# EAGLE schematic CFO_nano_protoWithDACandOpAmpMCP4822 (EAGLE 9.2.2)
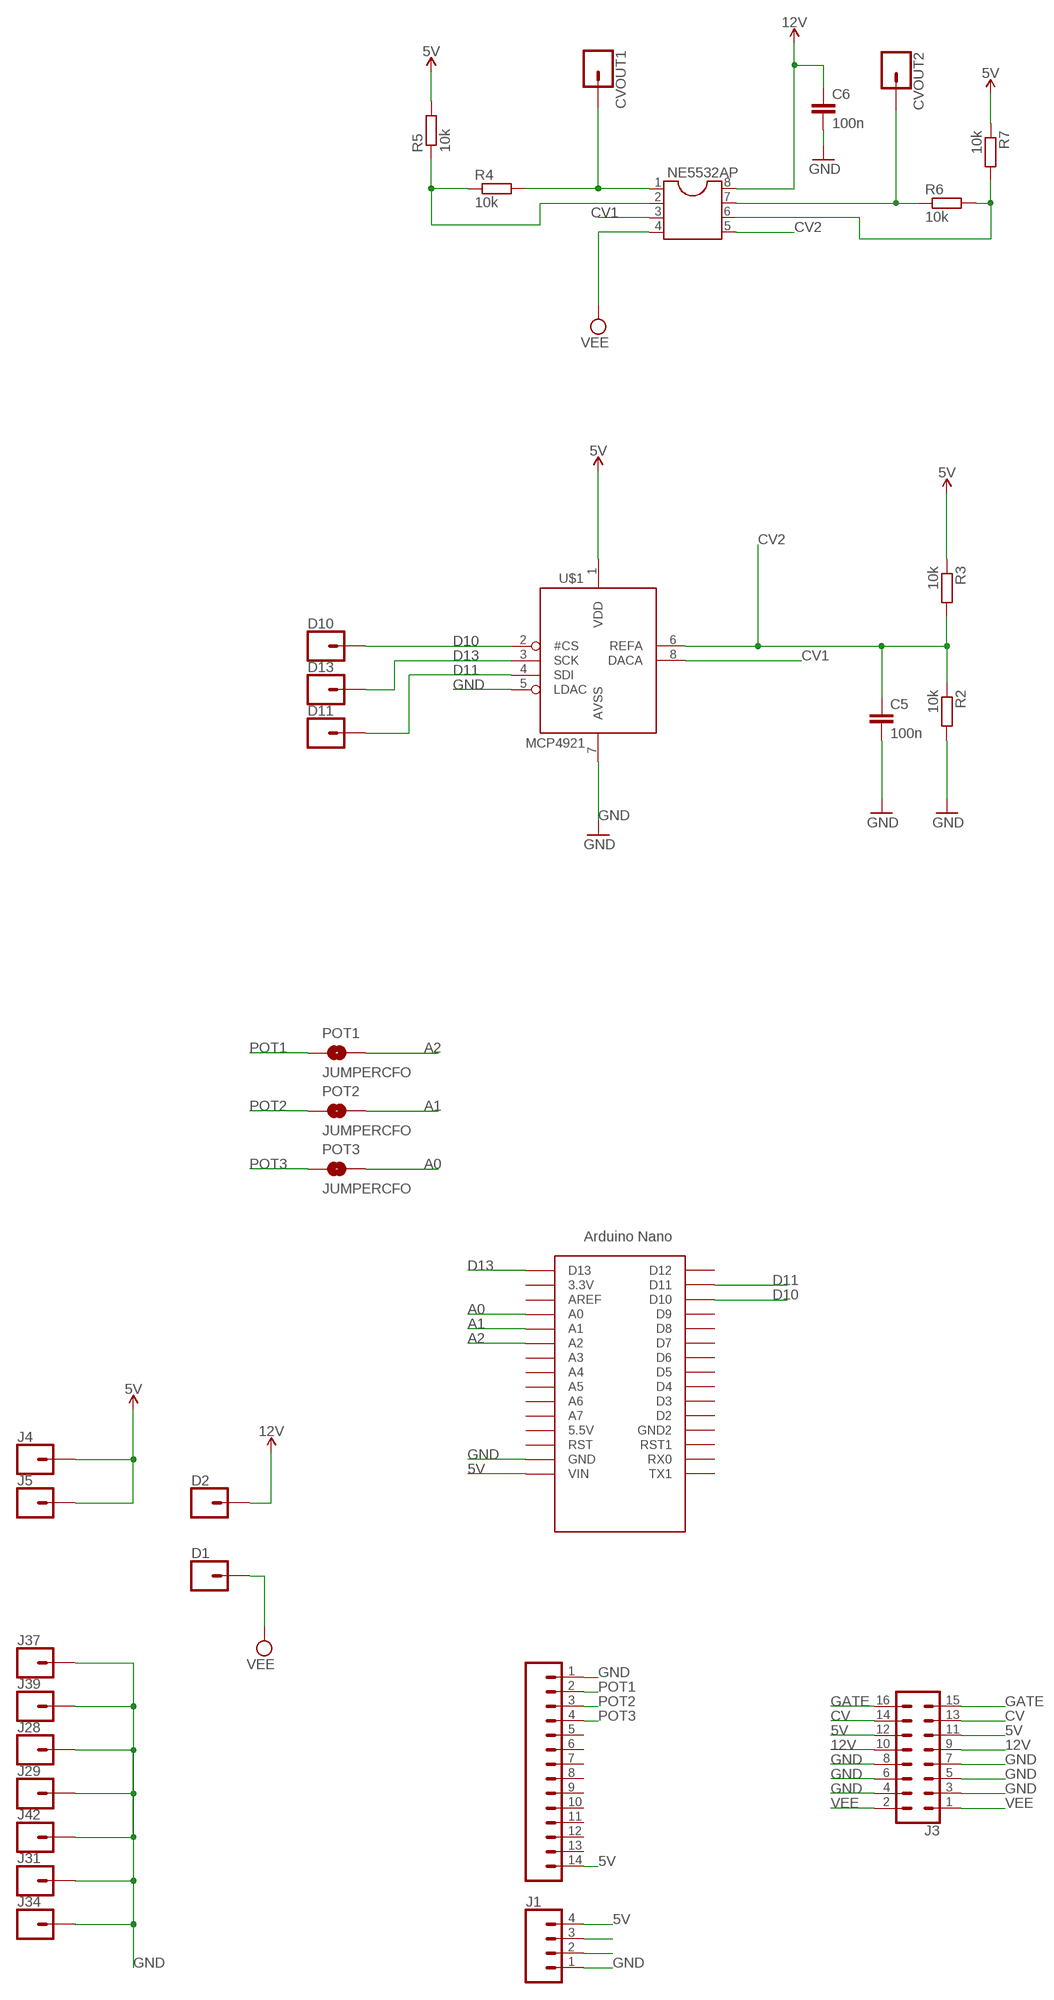
[diagram p0: schematic, sheet 1]

## Parts
C5  100n  C-EU050-025X075  [C050-025X075]
C6  100n  C-EU050-025X075  [C050-025X075]
CVOUT1  CONN_01  [1X01]
CVOUT2  CONN_01  [1X01]
D1  CONN_01  [1X01]
D2  CONN_01  [1X01]
D10  CONN_01  [1X01]
D11  CONN_01  [1X01]
D13  CONN_01  [1X01]
J1  CONN_04  [1X04]
J2  CONN_14SQUARE  [1X14]
J3  CONN_08X2_SHROUD  [2X8-SHROUDED_LOCK]
J4  CONN_01  [1X01]
J5  CONN_01  [1X01]
J28  CONN_01  [1X01]
J29  CONN_01  [1X01]
J31  CONN_01  [1X01]
J34  CONN_01  [1X01]
J37  CONN_01  [1X01]
J39  CONN_01  [1X01]
J42  CONN_01  [1X01]
NE5532AP  DIL8  [DIL08]
POT1  JUMPERCFO  [SMT-JUMPER_2_NO_NO-SILK_ROUND]
POT2  JUMPERCFO  [SMT-JUMPER_2_NO_NO-SILK_ROUND]
POT3  JUMPERCFO  [SMT-JUMPER_2_NO_NO-SILK_ROUND]
R2  10k  R-EU_0207/10  [0207/10]
R3  10k  R-EU_0207/10  [0207/10]
R4  10k  R-EU_0207/10  [0207/10]
R5  10k  R-EU_0207/10  [0207/10]
R6  10k  R-EU_0207/10  [0207/10]
R7  10k  R-EU_0207/10  [0207/10]
U$1  MCP4921  [DIL08]
U$2  NANO  [NANO]

## Nets
5V: J1.4 J2.14 J3.11 J3.12 J4.1 J5.1 R3.1 R5.2 R7.1 U$1.1(VDD) U$2.VIN
12V: C6.1 D2.1 J3.9 J3.10 NE5532AP.8
A0: POT3.2 U$2.A0
A1: POT2.2 U$2.A1
A2: POT1.2 U$2.A2
CV: J3.13 J3.14
CV1: NE5532AP.3 U$1.8(DACA)
CV2: C5.1 NE5532AP.5 R2.1 R3.2 U$1.6(REFA)
CVOUT1: CVOUT1.1 NE5532AP.1 R4.2
CVOUT2: CVOUT2.1 NE5532AP.7 R6.1
D10: D10.1 U$1.2(#CS) U$2.D10
D11: D11.1 U$1.4(SDI) U$2.D11
D13: D13.1 U$1.3(SCK) U$2.D13
GATE: J3.15 J3.16
GND: C5.2 C6.2 J1.1 J2.1 J3.3 J3.4 J3.5 J3.6 J3.7 J3.8 J28.1 J29.1 J31.1 J34.1 J37.1 J39.1 J42.1 R2.2 U$1.5(LDAC) U$1.7(AVSS) U$2.GND
N$2: NE5532AP.6 R6.2 R7.2
N$4: NE5532AP.2 R4.1 R5.1
N$185: J1.3
N$186: J1.2
POT1: J2.2 POT1.1
POT2: J2.3 POT2.1
POT3: J2.4 POT3.1
VEE: D1.1 J3.1 J3.2 NE5532AP.4
Unconnected: J2.5 J2.6 J2.7 J2.8 J2.9 J2.10 J2.11 J2.12 J2.13 U$2.3.3V U$2.5V(5.5V) U$2.A3 U$2.A4 U$2.A5 U$2.A6 U$2.A7 U$2.AREF U$2.D2 U$2.D3 U$2.D4 U$2.D5 U$2.D6 U$2.D7 U$2.D8 U$2.D9 U$2.D12 U$2.GND1(GND2) U$2.RST U$2.RST1 U$2.RX0 U$2.TX1

## Library data of the parts
C5 C6 = rcl:C-EU: CAPACITOR, European symbol; SPICEPREFIX: C
CVOUT1 CVOUT2 D1 D2 D10 D11 D13 J4 J5 J28 J29 J31 J34 J37 J39 J42 = CFO:CONN_01: Single connection point. Often used as Generic Header-pin footprint for 0.1 inch spaced/style header connections On any of the 0.1 inch spaced packages, you can populate with these: Break Away Headers - Straight <https://www.sparkfun.com/products/116> (PRT-00116) Break Away Male Headers - Right Angle <https://www.sparkfun.com/products/553> (PRT-00553) Female Headers <https://www.sparkfun.com/products/115> (PRT-00115) Break Away Headers - Machine Pin <https://www.sparkfun.com/products/117> (PRT-00117) Break Away Female Headers - Swiss Machine Pin <https://www.sparkfun.com/products/743> (PRT-00743) This device is also useful as a general connection point to wire up your design to another part of your project. Our various solder wires solder well into these plated through hole pads. Hook-Up Wire - Assortment (Stranded, 22 AWG) <https://www.sparkfun.com/products/11375> (PRT-11375) Hook-Up Wire - Assortment (Solid Core, 22 AWG) <https://www.sparkfun.com/products/11367> (PRT-11367) View the entire wire category on our website here <https://www.sparkfun.com/categories/141> Special notes: SMTSO-256-ET is a "flush mount" nut for a 4-40 screw. We mostly use this on specialty testbeds; it is a nice way to connect hardware to your PCB at an adjustable hieght. Also note, the SNAP packages are for using a snappable style connector. We sell a baggie of snaps and they are also used on two LilyPad designs: Snap Assortment - 30 pack (male and female) <https://www.sparkfun.com/products/11347> (DEV-11347) LilyPad Arduino SimpleSnap <https://www.sparkfun.com/products/10941> (DEV-10941) LilyPad SimpleSnap Protoboard <https://www.sparkfun.com/products/10940> (DEV-10940)
J1 = CFO:CONN_04: Multi connection point. Often used as Generic Header-pin footprint for 0.1 inch spaced/style header connections On any of the 0.1 inch spaced packages, you can populate with these: Break Away Headers - Straight <https://www.sparkfun.com/products/116> (PRT-00116) Break Away Male Headers - Right Angle <https://www.sparkfun.com/products/553> (PRT-00553) Female Headers <https://www.sparkfun.com/products/115> (PRT-00115) Break Away Headers - Machine Pin <https://www.sparkfun.com/products/117> (PRT-00117) Break Away Female Headers - Swiss Machine Pin <https://www.sparkfun.com/products/743> (PRT-00743) For SCREWTERMINALS and SPRING TERMINALS visit here: Screw Terimnals on SparkFun.com <https://www.sparkfun.com/search/results?term=Screw+Terminals> (5mm/3.5mm/2.54mm spacing) This device is also useful as a general connection point to wire up your design to another part of your project. Our various solder wires solder well into these plated through hole pads. Hook-Up Wire - Assortment (Stranded, 22 AWG) <https://www.sparkfun.com/products/11375> (PRT-11375) Hook-Up Wire - Assortment (Solid Core, 22 AWG) <https://www.sparkfun.com/products/11367> (PRT-11367) View the entire wire category on our website here <https://www.sparkfun.com/categories/141> Special notes: Molex polarized connector foot print use with SKU : PRT-08231 with associated crimp pins and housings. 1MM SMD Version SKU: PRT-10208; PROD_ID: CONN-09696; SPICEPREFIX: E
J2 = CFO:CONN_14: Multi connection point. Often used as Generic Header-pin footprint for 0.1 inch spaced/style header connections On any of the 0.1 inch spaced packages, you can populate with these: Break Away Headers - Straight <https://www.sparkfun.com/products/116> (PRT-00116) Break Away Male Headers - Right Angle <https://www.sparkfun.com/products/553> (PRT-00553) Female Headers <https://www.sparkfun.com/products/115> (PRT-00115) Break Away Headers - Machine Pin <https://www.sparkfun.com/products/117> (PRT-00117) Break Away Female Headers - Swiss Machine Pin <https://www.sparkfun.com/products/743> (PRT-00743) For SCREWTERMINALS and SPRING TERMINALS visit here: Screw Terimnals on SparkFun.com <https://www.sparkfun.com/search/results?term=Screw+Terminals> (5mm/3.5mm/2.54mm spacing) This device is also useful as a general connection point to wire up your design to another part of your project. Our various solder wires solder well into these plated through hole pads. Hook-Up Wire - Assortment (Stranded, 22 AWG) <https://www.sparkfun.com/products/11375> (PRT-11375) Hook-Up Wire - Assortment (Solid Core, 22 AWG) <https://www.sparkfun.com/products/11367> (PRT-11367) View the entire wire category on our website here <https://www.sparkfun.com/categories/141> Special notes: Molex polarized connector foot print use with SKU : PRT-08231 with associated crimp pins and housings. 1MM SMD Version SKU: PRT-10208 NOTES ON THE VARIANTS LOCK and LOCK_LONGPADS... This footprint was designed to help hold the alignment of a through-hole component (i.e. 6-pin header) while soldering it into place. You may notice that each hole has been shifted either up or down by 0.005 of an inch from it's more standard position (which is a perfectly straight line). This slight alteration caused the pins (the squares in the middle) to touch the edges of the holes. Because they are alternating, it causes a "brace" to hold the component in place. 0.005 has proven to be the perfect amount of "off-center" position when using our standard breakaway headers. Although looks a little odd when you look at the bare footprint, once you have a header in there, the alteration is very hard to notice. Also,if you push a header all the way into place, it is covered up entirely on the bottom side.; SPICEPREFIX: X
J3 = CFO:CONN_08X2: Multi connection point. Often used as Generic Header-pin footprint for 0.1 inch spaced/style header connections You can populate with any combo of single row headers, but if you'd like an exact match, check this: Header - 2x8 (Male, 0.1") <https://www.sparkfun.com/products/13156> (PRT-13156) On any of the 0.1 inch spaced packages, you can populate with these: Break Away Headers - Straight <https://www.sparkfun.com/products/116> (PRT-00116) Break Away Male Headers - Right Angle <https://www.sparkfun.com/products/553> (PRT-00553) Female Headers <https://www.sparkfun.com/products/115> (PRT-00115) Break Away Headers - Machine Pin <https://www.sparkfun.com/products/117> (PRT-00117) Break Away Female Headers - Swiss Machine Pin <https://www.sparkfun.com/products/743> (PRT-00743)
NE5532AP = ic-package:DIL8: Dual In Line / Socket
POT1-POT3 = CFO:JUMPER: Normally open jumper This jumper has two pads in close proximity to each other. Apply solder to close the connection.
R2-R7 = rcl:R-EU_: RESISTOR, European symbol; SPICEPREFIX: R
U$1 = adafruit:MCP4921
U$2 = CFO:NANO: Arduino Nano